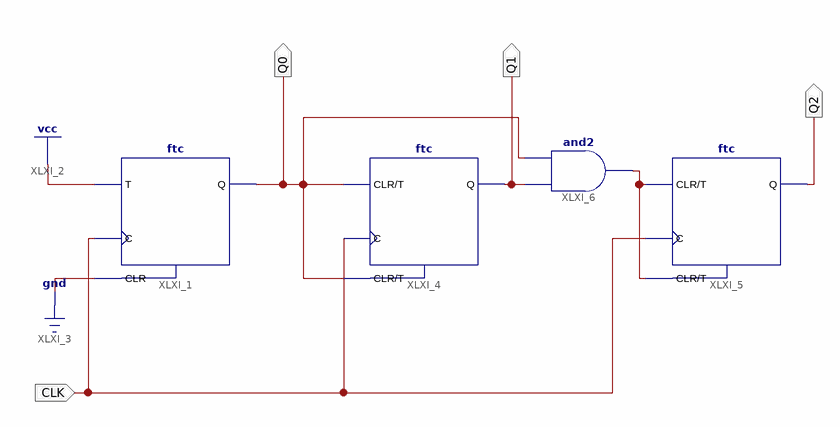
[diagram p0: schematic sheet 1]
// Xilinx ISE schematic Q2.sch (spartan6) as structural Verilog: 4 symbols, 4 ports
module Q2 (
  input  CLK,
  output Q0,
  output Q1,
  output Q2
);

  wire XLXN_9;

  ftc XLXI_1 (.C(CLK), .CLR(1'b0), .T(1'b1), .Q(Q0));
  ftc XLXI_4 (.C(CLK), .CLR(Q0), .T(Q0), .Q(Q1));
  ftc XLXI_5 (.C(CLK), .CLR(XLXN_9), .T(XLXN_9), .Q(Q2));
  and XLXI_6 (XLXN_9, Q1, Q0);
endmodule
